# Altium schematic sheet LDO.SchDoc
size A4; SheetNumber: 1; SheetTotal: 1
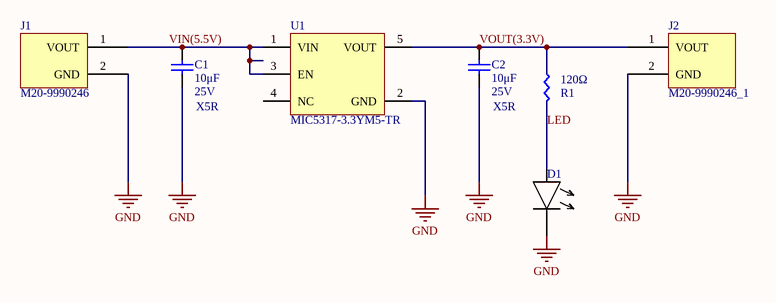
[diagram p0: LDO.SchDoc]

## Parts
C1  value 10μF  Voltage Rating: 25V  Class: X5R  [CAP0805]  (hidden comment: GCM21BR71E105KA56L)
C2  value 10μF  Voltage Rating: 25V  Class: X5R  [CAP0805]  (hidden comment: GCM21BR71E105KA56L)
D1  (no value)  [FP-LTST-C170GKT-MFG]
J1  M20-9990246  [FP-M20-9990246-MFG - duplicate]
J2  M20-9990246_1  [FP-M20-9990246-MFG - duplicate]
R1  value 120Ω  [RES0603]  (hidden comment: RNCP0603FTD10K0)
U1  MIC5317-3.3YM5-TR  [SOT95P245X145-5N]

## Nets
GND: C1.1 C2.1 J1.2(GND) J2.2(GND) U1.2(GND)
VIN(5.5V): C1.2 J1.1(VOUT) U1.1(VIN) U1.3(EN)
VOUT(3.3V): C2.2 J2.1(VOUT) U1.5(VOUT)

Not connected (* = marked no-connect by the designer): U1 4(NC)

## Notes on the sheet
- Labels drawn without touching a wire or pin: GND

## Library data of the parts
C1 C2 = GCM21BR71E105KA56L: CAP CER 1UF 25V X7R 0805; Manufacturer 1: Murata; Supplier 1: Digi-Key; Manufacturer Part Number 1: GCM21BR71E105KA56L; Supplier Part Number 1: 490-4785-1-ND
D1 = LTST-C170GKT: LED GREEN CLEAR SMD; Manufacturer 1: Lite-On Inc.; Supplier Part Number: 160-1179-2-ND; Supplier: DigiKey; Manfacturer Part Number: LTST-C170GKT
J1 = M20-9990246: CONN HEADER VERT 2POS 2.54MM; Manufacturer: Harwin Inc.; Manufacturer Part Number: M20-9990246; Supplier: DigiKey; Supplier Part Number: 952-2262-ND
J2 = M20-9990246_1: CONN HEADER VERT 2POS 2.54MM; Manufacturer: Harwin Inc.; Manufacturer Part Number: M20-9990246; Supplier: DigiKey; Supplier Part Number: 952-2262-ND
R1 = RNCP0603FTD10K0: RES 10K OHM 1% 1/8W 0603; Manufacturer 1: Stackpole Electronics Inc; Manufacturer Part Number 1: RNCP0603FTD10K0; Supplier Part Number 1: RNCP0603FTD10K0CT-ND; Supplier 1: Digi-Key; Power Rating: 1/8W
U1 = MIC5317-3.3YM5-TR: C REG LINEAR 3.3V 150MA SOT23-5; Manufacturer: Microchip Technology; Manufacturer Part Number: MIC5317-3.3YM5-TR; Supplier: Digikey; Supplier Part Number: MIC5317-3.3YM5-TR-ND